# EAGLE schematic Smart_Charger (1) (EAGLE 8.4.2)
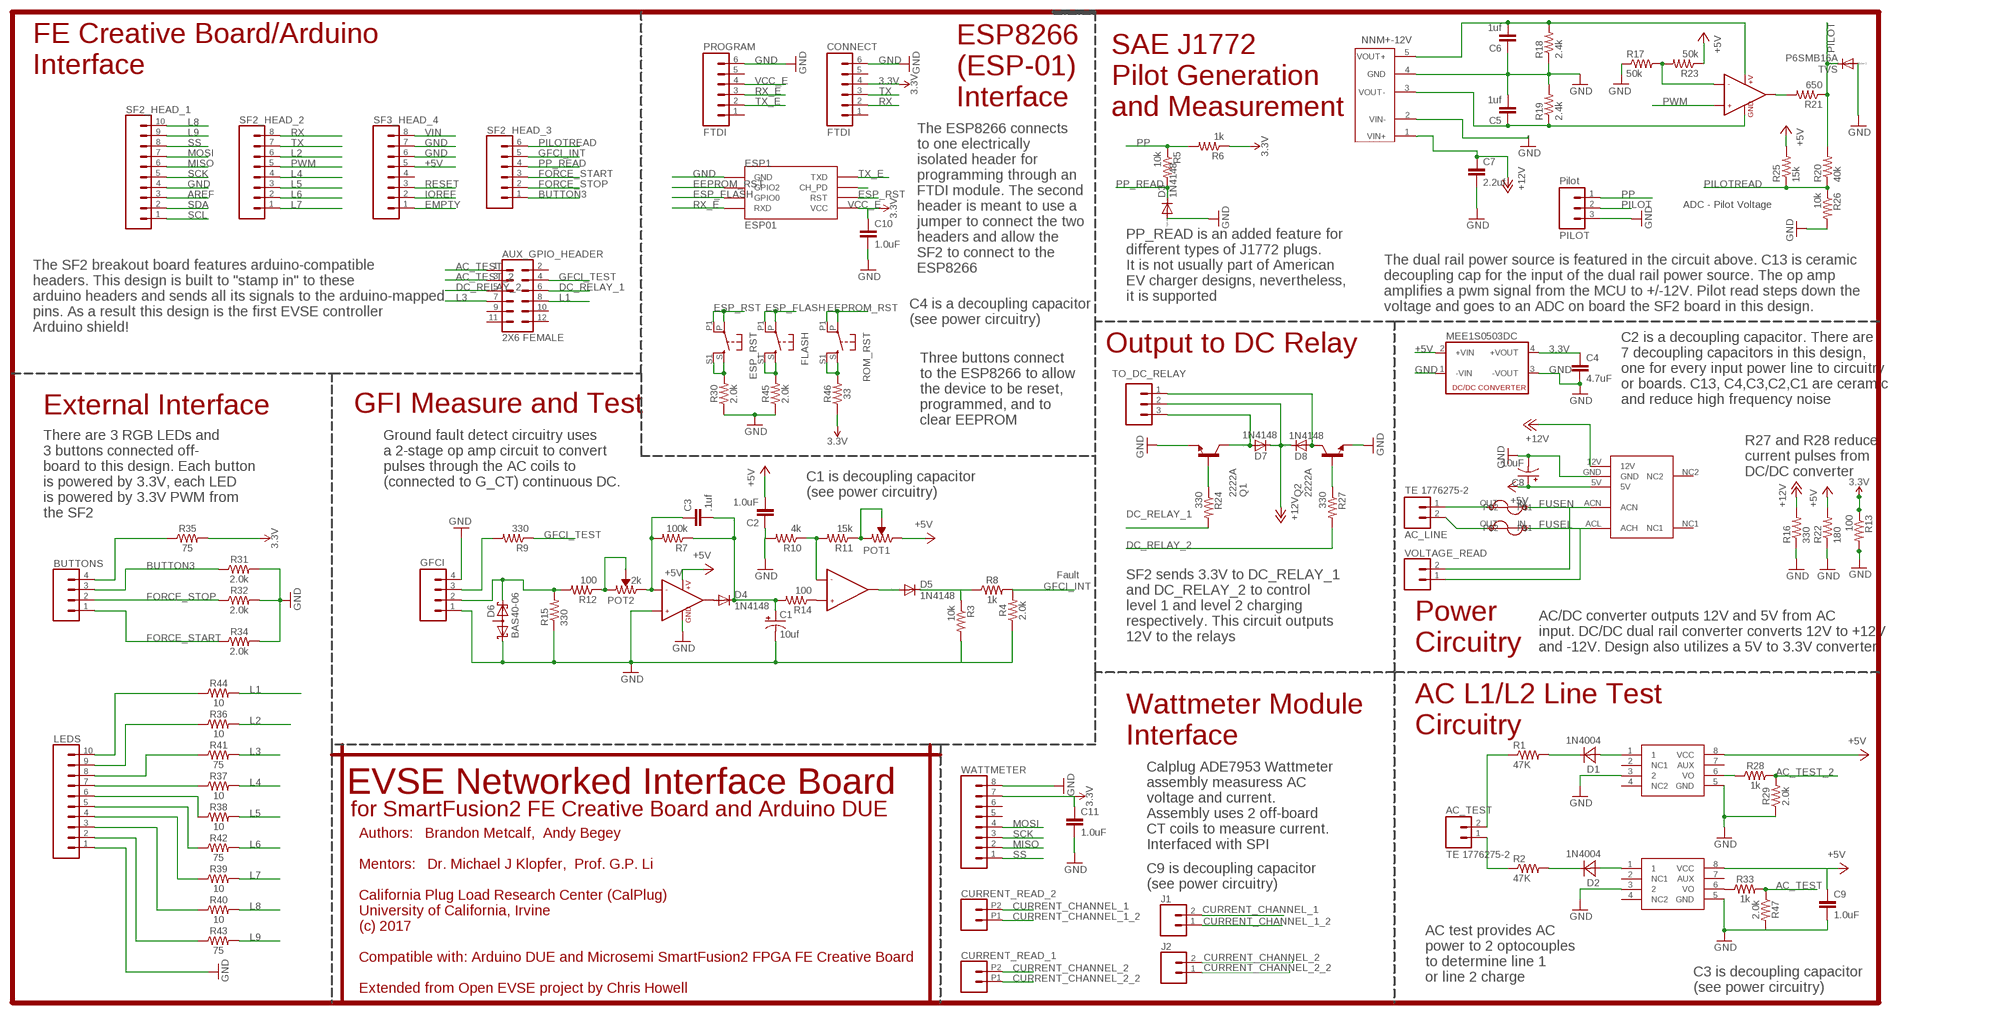
[diagram p0: schematic, sheet 1]

## Parts
AC_LINE  TE 1776275-2  M023.5MM_LOCK  [SCREWTERMINAL-3.5MM-2_LOCK]
AC_TEST  TE 1776275-2  M023.5MM_LOCK  [SCREWTERMINAL-3.5MM-2_LOCK]
AUX_GPIO_HEADER  2X6 FEMALE  CONN_06X2PTH_FEMALE  [2X6]
BUTTONS  CONN_04  [1X04]
C1  10uf  CAP_POL1206  [EIA3216]
C2  1.0uF  1.0UF-0805-25V-(+80/-20%)  [0805]
C3  .1uf  CAP0805  [0805]
C4  4.7uF  1.0UF-0805-25V-(+80/-20%)  [0805]
C5  1uf  CAP0805  [0805]
C6  1uf  CAP0805  [0805]
C7  2.2uf  CAP0805  [0805]
C8  10uF  10UF-POLAR-EIA3216-16V-10%(TANT)  [EIA3216]
C9  1.0uF  1.0UF-0805-25V-(+80/-20%)  [0805]
C10  1.0uF  1.0UF-0805-25V-(+80/-20%)  [0805]
C11  1.0uF  1.0UF-0805-25V-(+80/-20%)  [0805]
CONNECT  FTDI  M06SIP  [1X06]
CURRENT_READ_1  CONN_022.54MM_SCREWTERM  [1X02_2.54_SCREWTERM]
CURRENT_READ_2  CONN_022.54MM_SCREWTERM  [1X02_2.54_SCREWTERM]
D1  1N4004  MBRA340T3  [SMA]
D2  1N4004  MBRA340T3  [SMA]
D3  1N4148  DIODE-SOD123  [SOD123]
D4  1N4148  DIODE-SOD123  [SOD123]
D5  1N4148  DIODE-SOD123  [SOD123]
D6  BAS40-06  [SOT23]
D7  1N4148  DIODE-SOD123  [SOD123]
D8  1N4148  DIODE-SOD123  [SOD123]
DC1  MPM-04E-1205  [MPM-04E-1205]
DC2  NNM+-12V  [DIP_5]
ESP1  ESP01  [ESP01]
ESP_RST  10-XX-4.5SMD  [BT4.5X4.5]
F1  BEL1AFUSE  [BELFUSE1A]
F2  BEL1AFUSE  [BELFUSE1A]
FLASH  10-XX-4.5SMD  [BT4.5X4.5]
GFCI  M04LOCK  [1X04_LOCK]
IC1  MID400  [DIP08]
IC2  MID400  [DIP08]
IC3  LMV358  [SO08]
IC4  LMV358  [SO08]
J1  CONN_02  [1X02]
J2  CONN_02  [1X02]
LEDS  CONN_10"  [1X10]
MEE1S0503DC  NKE0305DC  [4SIL]
PILOT  Pilot  M03SCREW_LOCK  [SCREWTERMINAL-3.5MM-3_LOCK.007S]
POT1  10k  PVG3G  [PV3G]
POT2  2k  PVG3G  [PV3G]
PROGRAM  FTDI  M06SIP  [1X06]
Q1  2222A  BCX70SMD  [SOT23]
Q2  2222A  BCX70SMD  [SOT23]
R1  47K  RESISTORPTH-1/4W  [AXIAL-0.4]
R2  47K  RESISTORPTH-1/4W  [AXIAL-0.4]
R3  10k  RESISTOR0603-RES  [0603-RES]
R4  2.0k  2.0KOHM-0603-1/10W-5%  [0603]
R5  10k  RESISTOR0603-RES  [0603-RES]
R6  1k  RESISTOR0603-RES  [0603-RES]
R7  100k  RESISTOR0805-RES  [0805]
R8  1k  1KOHM-0603-1/10W-1%  [0603]
R9  330  RESISTOR0603-RES  [0603-RES]
R10  4k  RESISTOR0603-RES  [0603-RES]
R11  15k  RESISTOR0805-RES  [0805]
R12  100  RESISTOR0603-RES  [0603-RES]
R13  100  RESISTOR0603-RES  [0603-RES]
R14  100  RESISTOR0603-RES  [0603-RES]
R15  330  RESISTOR0603-RES  [0603-RES]
R16  330  R-US_R0603  [R0603]
R17  50k  RESISTOR0805-RES  [0805]
R18  2.4k  RESISTOR0603-RES  [0603-RES]
R19  2.4k  RESISTOR0603-RES  [0603-RES]
R20  40k  RESISTOR0603-RES  [0603-RES]
R21  650  RESISTOR0603-RES  [0603-RES]
R22  180  R-US_R0603  [R0603]
R23  50k  RESISTOR0805-RES  [0805]
R24  330  RESISTOR0603-RES  [0603-RES]
R25  15k  RESISTOR0603-RES  [0603-RES]
R26  10k  RESISTOR0603-RES  [0603-RES]
R27  330  RESISTOR0603-RES  [0603-RES]
R28  1k  1KOHM-0603-1/10W-1%  [0603]
R29  2.0k  2.0KOHM-0603-1/10W-5%  [0603]
R30  2.0k  2.0KOHM-0603-1/10W-5%  [0603]
R31  2.0k  2.0KOHM-0603-1/10W-5%  [0603]
R32  2.0k  2.0KOHM-0603-1/10W-5%  [0603]
R33  1k  1KOHM-0603-1/10W-1%  [0603]
R34  2.0k  2.0KOHM-0603-1/10W-5%  [0603]
R35  75  75KOHM-0603-1/10W-1%  [0603]
R36  10  10OHM-0603-1/10W-1%  [0603]
R37  10  10OHM-0603-1/10W-1%  [0603]
R38  10  10OHM-0603-1/10W-1%  [0603]
R39  10  10OHM-0603-1/10W-1%  [0603]
R40  10  10OHM-0603-1/10W-1%  [0603]
R41  75  75KOHM-0603-1/10W-1%  [0603]
R42  75  75KOHM-0603-1/10W-1%  [0603]
R43  75  75KOHM-0603-1/10W-1%  [0603]
R44  10  10OHM-0603-1/10W-1%  [0603]
R45  2.0k  2.0KOHM-0603-1/10W-5%  [0603]
R46  33  33OHM-0603-1/10W-1%  [0603]
R47  2.0k  2.0KOHM-0603-1/10W-5%  [0603]
ROM_RST  10-XX-4.5SMD  [BT4.5X4.5]
SF2_HEAD_1  CONN_10"  [1X10]
SF2_HEAD_2  CONN_08"  [1X08]
SF2_HEAD_3  CONN_06SILK_FEMALE_PTH  [1X06]
SF3_HEAD_4  CONN_08"  [1X08]
TO_DC_RELAY  M03SCREW_LOCK  [SCREWTERMINAL-3.5MM-3_LOCK.007S]
TVS  P6SMB16A  DIODE-SMB  [SMB]
VOLTAGE_READ  CONN_025MM  [SCREWTERMINAL-5MM-2]
WATTMETER  CONN_08"  [1X08]

## Nets
3.3V: C4.1 C11.1 CONNECT.4 MEE1S0503DC.4(+VOUT) R6.1 R13.1 R35.2 R46.1 WATTMETER.7
12V: C6.2 DC2.5(VOUT+) IC4.8(+V) R18.2
+5V: C2.2 C8.+ C9.1 DC1.5V IC1.8(VCC) IC2.8(VCC) IC3.8(+V) MEE1S0503DC.2(+VIN) POT1.P$3(CW) R22.2 R23.1 R25.2 SF3_HEAD_4.5
+12V: C7.1 D7.C D8.C DC1.12V DC2.1(VIN+) R16.2 TO_DC_RELAY.2
-12V: C5.1 DC2.3(VOUT-) IC4.4(GND) R19.1
AC_TEST: AUX_GPIO_HEADER.1 R33.2 R47.1
AC_TEST_2: AUX_GPIO_HEADER.3 R28.2 R29.2
AREF: SF2_HEAD_1.3
BUTTON3: BUTTONS.3 R31.1 SF2_HEAD_3.1
CURRENT_CHANNEL_1: CURRENT_READ_2.P2 J1.2
CURRENT_CHANNEL_1_2: CURRENT_READ_2.P1 J1.1
CURRENT_CHANNEL_2: CURRENT_READ_1.P2 J2.2
CURRENT_CHANNEL_2_2: CURRENT_READ_1.P1 J2.1
DC_RELAY_1: AUX_GPIO_HEADER.6 R24.2
DC_RELAY_2: AUX_GPIO_HEADER.5 R27.2
EEPROM_RST: ESP1.GPIO2 ROM_RST.P ROM_RST.P1
EMPTY: SF3_HEAD_4.1
ESP_FLASH: ESP1.GPIO0 FLASH.P FLASH.P1
ESP_RST: ESP1.RST ESP_RST.P ESP_RST.P1
FORCE_START: BUTTONS.1 R34.1 SF2_HEAD_3.3
FORCE_STOP: BUTTONS.2 R32.1 SF2_HEAD_3.2
FUSEL: DC1.ACL(ACH) F2.IN VOLTAGE_READ.1
FUSEN: DC1.ACN F1.IN VOLTAGE_READ.2
GFCI_INT: R4.2 R8.2 SF2_HEAD_3.5
GFCI_TEST: AUX_GPIO_HEADER.4 R9.1
GND: C1.C(-) C2.1 C4.2 C5.2 C6.1 C7.2 C8.- C9.2 C10.2 C11.2 CONNECT.6 D3.A D6.1(K1) DC1.GND DC2.2(VIN-) DC2.4(GND) ESP1.GND GFCI.1 GFCI.4 IC1.3 IC1.5(GND) IC2.3 IC2.5(GND) IC3.3(+IN1) IC3.4(GND) LEDS.1 MEE1S0503DC.1(-VIN) MEE1S0503DC.3(-VOUT) PILOT.3 PROGRAM.6 Q1.2(E) Q2.2(E) R3.2 R4.1 R10.2 R13.2 R15.1 R16.1 R17.1 R18.1 R19.2 R22.1 R26.2 R29.1 R30.1 R31.2 R32.2 R34.2 R45.1 R47.2 SF2_HEAD_1.4 SF3_HEAD_4.6 SF3_HEAD_4.7 TVS.A
IOREF: SF3_HEAD_4.2
L1: AUX_GPIO_HEADER.8 R44.2
L2: R36.2 SF2_HEAD_2.6
L3: AUX_GPIO_HEADER.7 R41.2
L4: R37.2 SF2_HEAD_2.4
L5: R38.2 SF2_HEAD_2.3
L6: R42.2 SF2_HEAD_2.2
L7: R39.2 SF2_HEAD_2.1
L8: R40.2 SF2_HEAD_1.10
L9: R43.2 SF2_HEAD_1.9
MISO: SF2_HEAD_1.6 WATTMETER.2
MOSI: SF2_HEAD_1.7 WATTMETER.4
N$1: D8.A Q2.3(C) TO_DC_RELAY.1
N$2: Q2.1(B) R27.1
N$3: IC2.6(VO) R28.1
N$4: D5.C R3.1 R8.1
N$5: POT2.P$1(CCW) POT2.P$2(WIPER) R12.1
N$6: D7.A Q1.3(C) TO_DC_RELAY.3
N$7: POT1.P$1(CCW) POT1.P$2(WIPER) R11.1
N$8: C3.1 IC3.2(-IN1) POT2.P$3(CW) R7.2
N$9: D1.C R1.P$2
N$10: IC4.2(-IN1) R17.2 R23.2
N$11: IC4.1(OUT1) R21.2
N$12: AC_LINE.2 F2.OUT
N$13: AC_LINE.1 F1.OUT
N$14: LEDS.10 R44.1
N$15: LEDS.9 R36.1
N$16: LEDS.8 R41.1
N$17: AC_TEST.2 R1.P$1
N$18: LEDS.7 R37.1
N$19: D1.A IC2.1
N$20: D6.2(K2) GFCI.2 R12.2 R15.2
N$21: D4.A IC3.1(OUT1)
N$22: GFCI.3 R9.2
N$23: C1.A(+) C3.2 D4.C R7.1 R14.2
N$24: IC3.6(-IN2) R10.1 R11.2
N$25: D5.A IC3.7(OUT2)
N$26: IC3.5(+IN2) R14.1
N$27: D2.C R2.P$2
N$28: D2.A IC1.1
N$29: AC_TEST.1 R2.P$1
N$30: Q1.1(B) R24.1
N$50: LEDS.6 R38.1
N$51: LEDS.5 R42.1
N$52: LEDS.4 R39.1
N$54: LEDS.2 R43.1
N$73: ESP1.CH_PD
N$75: LEDS.3 R40.1
N$77: R46.2 ROM_RST.S ROM_RST.S1
N$78: FLASH.S FLASH.S1 R45.2
N$81: IC1.6(VO) R33.1
N$83: ESP_RST.S ESP_RST.S1 R30.2
N$93: BUTTONS.4 R35.1
NC3: WATTMETER.8 ; supply symbol labelled GND
PILOT: PILOT.2 R20.2 R21.1 TVS.C
PILOTREAD: R20.1 R25.1 R26.1 SF2_HEAD_3.6
PP: PILOT.1 R5.1 R6.2
PP_READ: D3.C R5.2 SF2_HEAD_3.4
PWM: IC4.3(+IN1) SF2_HEAD_2.5
RESET: SF3_HEAD_4.3
RX: CONNECT.2 SF2_HEAD_2.8
RX_E: ESP1.RX(RXD) PROGRAM.3
SCK: SF2_HEAD_1.5 WATTMETER.3
SCL: SF2_HEAD_1.1
SDA: SF2_HEAD_1.2
SS: SF2_HEAD_1.8 WATTMETER.1
TX: CONNECT.3 SF2_HEAD_2.7
TX_E: ESP1.TX(TXD) PROGRAM.2
VCC_E: C10.1 ESP1.VCC PROGRAM.4 ; supply symbol labelled 3.3V
VIN: SF3_HEAD_4.8
Unconnected: AUX_GPIO_HEADER.2 AUX_GPIO_HEADER.9 AUX_GPIO_HEADER.10 AUX_GPIO_HEADER.11 AUX_GPIO_HEADER.12 CONNECT.1 CONNECT.5 D6.3(AA) DC1.NC1 DC1.NC2 IC1.2(NC1) IC1.4(NC2) IC1.7(AUX) IC2.2(NC1) IC2.4(NC2) IC2.7(AUX) IC4.5(+IN2) IC4.6(-IN2) IC4.7(OUT2) PROGRAM.1 PROGRAM.5 SF3_HEAD_4.4 WATTMETER.5 WATTMETER.6

## Notes on the sheet
- FE Creative Board/Arduino
  Interface
- ESP8266
  (ESP-01)
  Interface
- SAE J1772
  Pilot Generation
  and Measurement
- ADC - Pilot Voltage
- The ESP8266 connects
  to one electrically
  isolated header for 
  programming through an
  FTDI module. The second
  header is meant to use a
  jumper to connect the two
  headers and allow the
  SF2 to connect to the 
  ESP8266
- PP_READ is an added feature for
  different types of J1772 plugs.
  It is not usually part of American
  EV charger designs, nevertheless,
  it is supported
- The dual rail power source is featured in the circuit above. C13 is ceramic
  decoupling cap for the input of the dual rail power source. The op amp
  amplifies a pwm signal from the MCU to +/-12V. Pilot read steps down the
  voltage and goes to an ADC on board the SF2 board in this design.
- C4 is a decoupling capacitor
  (see power circuitry)
- The SF2 breakout board features arduino-compatible
  headers. This design is built to "stamp in" to these
  arduino headers and sends all its signals to the arduino-mapped
  pins. As a result this design is the first EVSE controller
  Arduino shield!
- Output to DC Relay
- C2 is a decoupling capacitor. There are
  7 decoupling capacitors in this design,
  one for every input power line to circuitry
  or boards. C13, C4,C3,C2,C1 are ceramic 
  and reduce high frequency noise
- External Interface | GFI Measure and Test
- Three buttons connect
  to the ESP8266 to allow
  the device to be reset,
  programmed, and to
  clear EEPROM
- R27 and R28 reduce
  current pulses from
  DC/DC converter
- Ground fault detect circuitry uses
  a 2-stage op amp circuit to convert
  pulses through the AC coils to
  (connected to G_CT) continuous DC.
- C1 is decoupling capacitor
  (see power circuitry)
- There are 3 RGB LEDs and
  3 buttons connected off-
  board to this design. Each button
  is powered by 3.3V, each LED
  is powered by 3.3V PWM from
  the SF2
- Fault
- SF2 sends 3.3V to DC_RELAY_1
  and DC_RELAY_2 to control
  level 1 and level 2 charging
  respectively. This circuit outputs
  12V to the relays
- Power
  Circuitry
- AC/DC converter outputs 12V and 5V from AC
  input. DC/DC dual rail converter converts 12V to +12V
  and -12V. Design also utilizes a 5V to 3.3V converter
- AC L1/L2 Line Test
  Circuitry
- Wattmeter Module
  Interface
- EVSE Networked Interface Board
- for SmartFusion2 FE Creative Board and Arduino DUE
- Calplug ADE7953 Wattmeter
  assembly measuress AC
  voltage and current. 
  Assembly uses 2 off-board
  CT coils to measure current.
  Interfaced with SPI
- C9 is decoupling capacitor
  (see power circuitry)
- AC test provides AC
  power to 2 optocouples
  to determine line 1
  or line 2 charge
- C3 is decoupling capacitor
  (see power circuitry)
- Authors:   Brandon Metcalf,  Andy Begey
  
  Mentors:   Dr. Michael J Klopfer,  Prof. G.P. Li
  
  California Plug Load Research Center (CalPlug)
  University of California, Irvine
  (c) 2017
  
  Compatible with: Arduino DUE and Microsemi SmartFusion2 FPGA FE Creative Board
  
  Extended from Open EVSE project by Chris Howell

## Library data of the parts
AC_LINE AC_TEST = SparkFun:M02: Header 2 Standard 2-pin 0.1" header. Use with straight break away headers (SKU : PRT-00116), right angle break away headers (PRT-00553), swiss pins (PRT-00743), machine pins (PRT-00117), and female headers (PRT-00115). Molex polarized connector foot print use with SKU : PRT-08233 with associated crimp pins and housings.
AUX_GPIO_HEADER = SparkFun-Connectors:CONN_06X2: Multi connection point. Often used as Generic Header-pin footprint for 0.1 inch spaced/style header connections On any of the 0.1 inch spaced packages, you can populate with these: Break Away Headers - Straight <https://www.sparkfun.com/products/116> (PRT-00116) Break Away Male Headers - Right Angle <https://www.sparkfun.com/products/553> (PRT-00553) Female Headers <https://www.sparkfun.com/products/115> (PRT-00115) Break Away Headers - Machine Pin <https://www.sparkfun.com/products/117> (PRT-00117) Break Away Female Headers - Swiss Machine Pin <https://www.sparkfun.com/products/743> (PRT-00743); PROD_ID: CONN-12423
BUTTONS = SparkFun-Connectors:CONN_04: Multi connection point. Often used as Generic Header-pin footprint for 0.1 inch spaced/style header connections On any of the 0.1 inch spaced packages, you can populate with these: Break Away Headers - Straight <https://www.sparkfun.com/products/116> (PRT-00116) Break Away Male Headers - Right Angle <https://www.sparkfun.com/products/553> (PRT-00553) Female Headers <https://www.sparkfun.com/products/115> (PRT-00115) Break Away Headers - Machine Pin <https://www.sparkfun.com/products/117> (PRT-00117) Break Away Female Headers - Swiss Machine Pin <https://www.sparkfun.com/products/743> (PRT-00743) For SCREWTERMINALS and SPRING TERMINALS visit here: Screw Terimnals on SparkFun.com <https://www.sparkfun.com/search/results?term=Screw+Terminals> (5mm/3.5mm/2.54mm spacing) This device is also useful as a general connection point to wire up your design to another part of your project. Our various solder wires solder well into these plated through hole pads. Hook-Up Wire - Assortment (Stranded, 22 AWG) <https://www.sparkfun.com/products/11375> (PRT-11375) Hook-Up Wire - Assortment (Solid Core, 22 AWG) <https://www.sparkfun.com/products/11367> (PRT-11367) View the entire wire category on our website here <https://www.sparkfun.com/categories/141> Special notes: Molex polarized connector foot print use with SKU : PRT-08231 with associated crimp pins and housings. 1MM SMD Version SKU: PRT-10208; PROD_ID: CONN-09696
C1 = SparkFun:CAP_POL: Capacitor Polarized These are standard SMD and PTH capacitors. Normally 10uF, 47uF, and 100uF in electrolytic and tantalum varieties. Always verify the external diameter of the through hole cap, it varies with capacity, voltage, and manufacturer. The EIA devices should be standard.
C2 C9-C11 = SparkFun-Capacitors:1.0UF: 1µF ceramic capacitors A capacitor is a passive two-terminal electrical component used to store electrical energy temporarily in an electric field.; PROD_ID: CAP-11625
C3 C5-C7 = SparkFun:CAP: Capacitor Standard 0603 ceramic capacitor, and 0.1" leaded capacitor.
C4 = SparkFun-Capacitors:1.0UF: 1µF ceramic capacitors A capacitor is a passive two-terminal electrical component used to store electrical energy temporarily in an electric field.; PROD_ID: CAP-11625; VALUE: 1.0uF
C8 = SparkFun-Capacitors:10UF-POLAR: 10.0µF polarized capacitors A capacitor is a passive two-terminal electrical component used to store electrical energy temporarily in an electric field.; PROD_ID: CAP-00811
CONNECT PROGRAM = SparkFun:M06: Header 6 Standard 6-pin 0.1" header. Use with straight break away headers (SKU : PRT-00116), right angle break away headers (PRT-00553), swiss pins (PRT-00743), machine pins (PRT-00117), and female headers (PRT-00115). Molex polarized connector foot print use with SKU : PRT-08094 with associated crimp pins and housings. NOTES ON THE VARIANTS LOCK and LOCK_LONGPADS... This footprint was designed to help hold the alignment of a through-hole component (i.e. 6-pin header) while soldering it into place. You may notice that each hole has been shifted either up or down by 0.005 of an inch from it's more standard position (which is a perfectly straight line). This slight alteration caused the pins (the squares in the middle) to touch the edges of the holes. Because they are alternating, it causes a "brace" to hold the component in place. 0.005 has proven to be the perfect amount of "off-center" position when using our standard breakaway headers. Although looks a little odd when you look at the bare footprint, once you have a header in there, the alteration is very hard to notice. Also, if you push a header all the way into place, it is covered up entirely on the bottom side. This idea of altering the position of holes to aid alignment will be further integrated into the Sparkfun Library for other footprints. It can help hold any component with 3 or more connection pins.
CURRENT_READ_1 CURRENT_READ_2 J1 J2 = SparkFun-Connectors:CONN_02: Multi connection point. Often used as Generic Header-pin footprint for 0.1 inch spaced/style header connections On any of the 0.1 inch spaced packages, you can populate with these: Break Away Headers - Straight <https://www.sparkfun.com/products/116> (PRT-00116) Break Away Male Headers - Right Angle <https://www.sparkfun.com/products/553> (PRT-00553) Female Headers <https://www.sparkfun.com/products/115> (PRT-00115) Break Away Headers - Machine Pin <https://www.sparkfun.com/products/117> (PRT-00117) Break Away Female Headers - Swiss Machine Pin <https://www.sparkfun.com/products/743> (PRT-00743) For SCREWTERMINALS and SPRING TERMINALS visit here: Screw Terimnals on SparkFun.com <https://www.sparkfun.com/search/results?term=Screw+Terminals> (5mm/3.5mm/2.54mm spacing) This device is also useful as a general connection point to wire up your design to another part of your project. Our various solder wires solder well into these plated through hole pads. Hook-Up Wire - Assortment (Stranded, 22 AWG) <https://www.sparkfun.com/products/11375> (PRT-11375) Hook-Up Wire - Assortment (Solid Core, 22 AWG) <https://www.sparkfun.com/products/11367> (PRT-11367) View the entire wire category on our website here <https://www.sparkfun.com/categories/141> Special notes: Molex polarized connector foot print use with: PRT-08233 with associated crimp pins and housings. 2.54_SCREWTERM for use with PRT-10571. 3.5mm Screw Terminal footprints for PRT-08084 5mm Screw Terminal footprints for use with PRT-08432
D1 D2 = diode:MBRA340T3: Surface Mount Schottky Power Rectifier Source: http://www.onsemi.com/pub_link/Collateral/MBRA340T3-D.PDF
D3-D5 D7 D8 TVS = diode:DIODE-: DIODE
D6 = diode:BAS40-06: Silicon Schottky Diodes General-purpose diode for high-speed switching
DC1 = Qxd:MPM-04E-1205; SPICEPREFIX: X
DC2 = DCDCconverters:NNM+-12V
ESP1 = esp8266modules:ESP01: ESP8266 Wifi module 01
ESP_RST FLASH ROM_RST = buttons:10-XX: OMRON SWITCH
F1 F2 = Qxd:BEL1AFUSE
GFCI = SparkFun:M04: Header 4 Standard 4-pin 0.1" header. Use with straight break away headers (SKU : PRT-00116), right angle break away headers (PRT-00553), swiss pins (PRT-00743), machine pins (PRT-00117), and female headers (PRT-00115). Molex polarized connector foot print use with SKU : PRT-08231 with associated crimp pins and housings. 1MM SMD Version SKU: PRT-10208
IC1 IC2 = SparkFun:MID400
IC3 IC4 = SparkFun:LMV358
LEDS SF2_HEAD_1 = SparkFun-Connectors:CONN_10: Multi connection point. Often used as Generic Header-pin footprint for 0.1 inch spaced/style header connections On any of the 0.1 inch spaced packages, you can populate with these: Break Away Headers - Straight <https://www.sparkfun.com/products/116> (PRT-00116) Break Away Male Headers - Right Angle <https://www.sparkfun.com/products/553> (PRT-00553) Female Headers <https://www.sparkfun.com/products/115> (PRT-00115) Break Away Headers - Machine Pin <https://www.sparkfun.com/products/117> (PRT-00117) Break Away Female Headers - Swiss Machine Pin <https://www.sparkfun.com/products/743> (PRT-00743) Arduino Stackable Header - 10 Pin <https://www.sparkfun.com/products/11376> (PRT-11376) For SCREWTERMINALS and SPRING TERMINALS visit here: Screw Terimnals on SparkFun.com <https://www.sparkfun.com/search/results?term=Screw+Terminals> (5mm/3.5mm/2.54mm spacing) This device is also useful as a general connection point to wire up your design to another part of your project. Our various solder wires solder well into these plated through hole pads. Hook-Up Wire - Assortment (Stranded, 22 AWG) <https://www.sparkfun.com/products/11375> (PRT-11375) Hook-Up Wire - Assortment (Solid Core, 22 AWG) <https://www.sparkfun.com/products/11367> (PRT-11367) View the entire wire category on our website here <https://www.sparkfun.com/categories/141> Special notes: Molex polarized connector foot print use with SKU : PRT-08231 with associated crimp pins and housings. 1MM SMD Version SKU: PRT-10208 NOTES ON THE VARIANTS LOCK and LOCK_LONGPADS... This footprint was designed to help hold the alignment of a through-hole component (i.e. 6-pin header) while soldering it into place. You may notice that each hole has been shifted either up or down by 0.005 of an inch from it's more standard position (which is a perfectly straight line). This slight alteration caused the pins (the squares in the middle) to touch the edges of the holes. Because they are alternating, it causes a "brace" to hold the component in place. 0.005 has proven to be the perfect amount of "off-center" position when using our standard breakaway headers. Although looks a little odd when you look at the bare footprint, once you have a header in there, the alteration is very hard to notice. Also,if you push a header all the way into place, it is covered up entirely on the bottom side.; PROD_ID: CONN-11563
MEE1S0503DC = NKE0503DC:NKE0305DC
PILOT TO_DC_RELAY = SparkFun:M03: Header 3 Standard 3-pin 0.1" header. Use with straight break away headers (SKU : PRT-00116), right angle break away headers (PRT-00553), swiss pins (PRT-00743), machine pins (PRT-00117), and female headers (PRT-00115). Molex polarized connector foot print use with SKU : PRT-08232 with associated crimp pins and housings.
POT1 POT2 = small_trimmer:PVG3G
Q1 Q2 = transistor-npn:BCX70*: NPN Transistor
R1-R3 R5-R7 R9-R15 R17-R21 R23-R27 = SparkFun:RESISTOR: Resistor Basic schematic elements and footprints for 0603, 1206, and PTH resistors.
R4 R29-R32 R34 R45 R47 = SparkFun-Resistors:2.0KOHM: 2kΩ resistor A resistor is a passive two-terminal electrical component that implements electrical resistance as a circuit element. Resistors act to reduce current flow, and, at the same time, act to lower voltage levels within circuits. - Wikipedia; PROD_ID: RES-08296
R8 R28 R33 = SparkFun-Resistors:1KOHM: 1kΩ resistor A resistor is a passive two-terminal electrical component that implements electrical resistance as a circuit element. Resistors act to reduce current flow, and, at the same time, act to lower voltage levels within circuits. - Wikipedia; PROD_ID: RES-07856
R16 R22 = rcl:R-US_: RESISTOR, American symbol
R35 R41-R43 = SparkFun-Resistors:75KOHM: 75Ω resistor A resistor is a passive two-terminal electrical component that implements electrical resistance as a circuit element. Resistors act to reduce current flow, and, at the same time, act to lower voltage levels within circuits. - Wikipedia; PROD_ID: RES-09737
R36-R40 R44 = SparkFun-Resistors:10OHM: 10Ω resistor A resistor is a passive two-terminal electrical component that implements electrical resistance as a circuit element. Resistors act to reduce current flow, and, at the same time, act to lower voltage levels within circuits. - Wikipedia; PROD_ID: RES-12581
R46 = SparkFun-Resistors:33OHM: 33Ω resistor A resistor is a passive two-terminal electrical component that implements electrical resistance as a circuit element. Resistors act to reduce current flow, and, at the same time, act to lower voltage levels within circuits. - Wikipedia; PROD_ID: RES-08270
SF2_HEAD_2 SF3_HEAD_4 WATTMETER = SparkFun-Connectors:CONN_08: Multi connection point. Often used as Generic Header-pin footprint for 0.1 inch spaced/style header connections On any of the 0.1 inch spaced packages, you can populate with these: Break Away Headers - Straight <https://www.sparkfun.com/products/116> (PRT-00116) Break Away Male Headers - Right Angle <https://www.sparkfun.com/products/553> (PRT-00553) Female Headers <https://www.sparkfun.com/products/115> (PRT-00115) Break Away Headers - Machine Pin <https://www.sparkfun.com/products/117> (PRT-00117) Break Away Female Headers - Swiss Machine Pin <https://www.sparkfun.com/products/743> (PRT-00743) Arduino Stackable Header - 8 Pin <https://www.sparkfun.com/products/9279> (PRT-09279) For SCREWTERMINALS and SPRING TERMINALS visit here: Screw Terimnals on SparkFun.com <https://www.sparkfun.com/search/results?term=Screw+Terminals> (5mm/3.5mm/2.54mm spacing) This device is also useful as a general connection point to wire up your design to another part of your project. Our various solder wires solder well into these plated through hole pads. Hook-Up Wire - Assortment (Stranded, 22 AWG) <https://www.sparkfun.com/products/11375> (PRT-11375) Hook-Up Wire - Assortment (Solid Core, 22 AWG) <https://www.sparkfun.com/products/11367> (PRT-11367) View the entire wire category on our website here <https://www.sparkfun.com/categories/141> Special notes: Molex polarized connector foot print use with SKU : PRT-08231 with associated crimp pins and housings. 1MM SMD Version SKU: PRT-10208 NOTES ON THE VARIANTS LOCK and LOCK_LONGPADS... This footprint was designed to help hold the alignment of a through-hole component (i.e. 6-pin header) while soldering it into place. You may notice that each hole has been shifted either up or down by 0.005 of an inch from it's more standard position (which is a perfectly straight line). This slight alteration caused the pins (the squares in the middle) to touch the edges of the holes. Because they are alternating, it causes a "brace" to hold the component in place. 0.005 has proven to be the perfect amount of "off-center" position when using our standard breakaway headers. Although looks a little odd when you look at the bare footprint, once you have a header in there, the alteration is very hard to notice. Also,if you push a header all the way into place, it is covered up entirely on the bottom side.; PROD_ID: CONN-08438
SF2_HEAD_3 = SparkFun-Connectors:CONN_06: Multi connection point. Often used as Generic Header-pin footprint for 0.1 inch spaced/style header connections On any of the 0.1 inch spaced packages, you can populate with these: Break Away Headers - Straight <https://www.sparkfun.com/products/116> (PRT-00116) Break Away Male Headers - Right Angle <https://www.sparkfun.com/products/553> (PRT-00553) Female Headers <https://www.sparkfun.com/products/115> (PRT-00115) Break Away Headers - Machine Pin <https://www.sparkfun.com/products/117> (PRT-00117) Break Away Female Headers - Swiss Machine Pin <https://www.sparkfun.com/products/743> (PRT-00743) Arduino Stackable Header - 6 Pin <https://www.sparkfun.com/products/9280> (PRT-09280) For SCREWTERMINALS and SPRING TERMINALS visit here: Screw Terimnals on SparkFun.com <https://www.sparkfun.com/search/results?term=Screw+Terminals> (5mm/3.5mm/2.54mm spacing) This device is also useful as a general connection point to wire up your design to another part of your project. Our various solder wires solder well into these plated through hole pads. Hook-Up Wire - Assortment (Stranded, 22 AWG) <https://www.sparkfun.com/products/11375> (PRT-11375) Hook-Up Wire - Assortment (Solid Core, 22 AWG) <https://www.sparkfun.com/products/11367> (PRT-11367) View the entire wire category on our website here <https://www.sparkfun.com/categories/141>; PROD_ID: CONN-08437
VOLTAGE_READ = SparkFun-Connectors:CONN_02: Multi connection point. Often used as Generic Header-pin footprint for 0.1 inch spaced/style header connections On any of the 0.1 inch spaced packages, you can populate with these: Break Away Headers - Straight <https://www.sparkfun.com/products/116> (PRT-00116) Break Away Male Headers - Right Angle <https://www.sparkfun.com/products/553> (PRT-00553) Female Headers <https://www.sparkfun.com/products/115> (PRT-00115) Break Away Headers - Machine Pin <https://www.sparkfun.com/products/117> (PRT-00117) Break Away Female Headers - Swiss Machine Pin <https://www.sparkfun.com/products/743> (PRT-00743) For SCREWTERMINALS and SPRING TERMINALS visit here: Screw Terimnals on SparkFun.com <https://www.sparkfun.com/search/results?term=Screw+Terminals> (5mm/3.5mm/2.54mm spacing) This device is also useful as a general connection point to wire up your design to another part of your project. Our various solder wires solder well into these plated through hole pads. Hook-Up Wire - Assortment (Stranded, 22 AWG) <https://www.sparkfun.com/products/11375> (PRT-11375) Hook-Up Wire - Assortment (Solid Core, 22 AWG) <https://www.sparkfun.com/products/11367> (PRT-11367) View the entire wire category on our website here <https://www.sparkfun.com/categories/141> Special notes: Molex polarized connector foot print use with: PRT-08233 with associated crimp pins and housings. 2.54_SCREWTERM for use with PRT-10571. 3.5mm Screw Terminal footprints for PRT-08084 5mm Screw Terminal footprints for use with PRT-08432; SF_SKU: PRT-08432